# Altium schematic sheet DOWNSTREAM.SchDoc
size A4; SheetNumber: 3; SheetTotal: 6
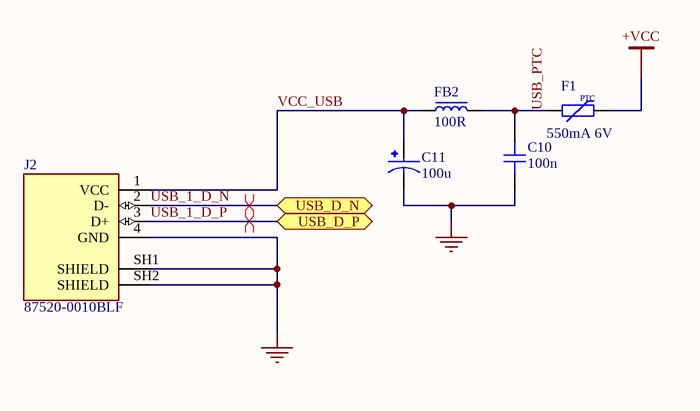
[diagram p0: DOWNSTREAM.SchDoc]

## Parts
C10  100n  [CAP_0805]
C11  100u  [CAP_EEEHA0J101WR]
F1  550mA 6V  [FUSE_1206]
FB2  100R  [FB_0603]
J2  87520-0010BLF  [AMPHENOL_87520-0010BLF]

## Ports
USB_D_N (bidir), USB_D_P (bidir)

## Nets
+VCC: F1.2
GND: C10.1 C11.2 J2.4(GND) J2.SH1(SHIELD) J2.SH2(SHIELD)
USB_1_D_N: J2.2(D-) ; port USB_D_N
USB_1_D_P: J2.3(D+) ; port USB_D_P
USB_PTC: C10.2 F1.1 FB2.2
VCC_USB: C11.1 FB2.1 J2.1(VCC)

## Layout directives
differential pair: USB_1_D_N, USB_1_D_P

## Notes on the sheet
- (in symbol FUSE_PPTC_1206) PTC

## Library data of the parts
C10 = CAP_0805: Capacitor SMD 0805; Manufacturer: *; Manufacturer Part Number: *; Distributor Link: *; LCSC: *; Rating: *; Dielectric: *
C11 = EEEHA0J101WR: CAPACITOR ALUM ELEC, 100UF, 20%, 6.3V, S; CAPACITOR ALUM ELEC, 100UF, 20%, 6.3V, SMD; Product Range:PANASONIC - HA Series; Capacitance:100ÂµF; Capacitance Tolerance:Â± 20%; Voltage Rating:6.3V; Capacitor Case Style:Radial Can - SMD; Diameter:5mm; Height:5.4mm; Series:HA; MF: Panasonic Electronic; MP: EEE-HA0J101WR; Availability: In Stock; Check_prices: https://www.snapeda.com/parts/EEE-HA0J101WR/Panasonic%20Electronic%20Components/view-part/2733110/?ref=eda; SnapEDA_Link: https://www.snapeda.com/parts/EEE-HA0J101WR/Panasonic%20Electronic%20Components/view-part/2733110/?ref=snap; Purchase-URL: https://pricing.snapeda.com/search/part/EEE-HA0J101WR/?ref=eda; Package: RADIAL-2 Panasonic; Value: *; Price: None
F1 = FUSE_PPTC_1206: Fuse PPTC SMD 1206; Manufacturer: *; Manufacturer Part Number: *
FB2 = FB_0603: Ferrite Bead SMD 0603; Manufacturer: *; Manufacturer Part Number: *; Distributor Link: *; LCSC: *
J2 = 87520-0010BLF: Conn Data USB TypeA Socket 4Cnts RightAngle ThruHole White 1.57mmPCB | Amphenol FCI (Amphenol CS) 87520-0010BLF; MF: AMPHENOL ICC / FCI; SnapEDA_Link: https://www.snapeda.com/parts/87520-0010BLF/Amphenol/view-part/?ref=snap; Package: None; Value: *; MP: 87520-0010BLF; Check_prices: https://www.snapeda.com/parts/87520-0010BLF/Amphenol/view-part/?ref=eda